# Altium project LM2587.PrjPcb
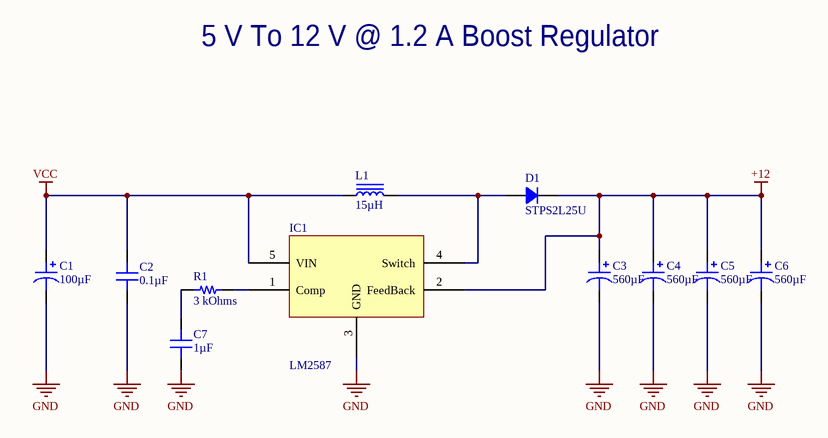
[diagram p0: LM2587.SchDoc]
1 sheet, 11 parts. Net scope: global (net labels, ports and power ports of the same name join across sheets).
Board file: LM2587.PcbDoc

## Sheet LM2587.SchDoc
size A4; SheetNumber: 1; SheetTotal: 1

### Parts
C1  100µF  [CAP ALSMD 6.6MM H5.4MM]
C2  0.1µF  [CAP 0805_2012]
C3  560µF  [CAP ALSMD 8.3MM H10.5MM]
C4  560µF  [CAP ALSMD 8.3MM H10.5MM]
C5  560µF  [CAP ALSMD 8.3MM H10.5MM]
C6  560µF  [CAP ALSMD 8.3MM H10.5MM]
C7  1µF  [CAP 0805_2012]
D1  STPS2L25U  [DO214AA SMB]
IC1  LM2587  [D2PAK - T0263]
L1  15µH  [7447070]
R1  3 kOhms  [RES 0805_2012]

### Nets
+12: C3.1 C4.1 C5.1 C6.1 D1.2 IC1.2(FeedBack)
GND: C1.2 C2.1 C3.2 C4.2 C5.2 C6.2 C7.1 IC1.3(GND)
VCC: C1.1 C2.2 IC1.5(VIN) L1.1
NetC7_2: C7.2 R1.1
NetD1_1: D1.1 IC1.4(Switch) L1.2
NetIC1_1: IC1.1(Comp) R1.2

### Notes on the sheet
- 5 V To 12 V @ 1.2 A Boost Regulator

### Library data of the parts
C1 = AVS107M16D16T-F: CAP ALUM 100UF 20% 16V SMD; Manufacturer: Cornell Dubilier Electronics (CDE); ESR (Equivalent Series Resistance): 4.3Ohm @ 120Hz; Lifetime @ Temp.: 2000 Hrs @ 85°C; Polarization: Polar; Ripple Current @ High Frequency: 119mA @ 10kHz; Ripple Current @ Low Frequency: 70mA @ 120Hz; Surface Mount Land Size: 0.260" L x 0.260" W (6.60mm x 6.60mm); Part Number: AVS107M16D16T-F; Applications: Automotive, Bypass, Decoupling; Capacitance: 100µF; ComponentLink1Description: Datasheet; ComponentLink1URL: http://www.cde.com/resources/catalogs/AVS.pdf; ComponentLink2Description: DigiKey Link; ComponentLink2URL: http://digikey.com/product-detail/en/cornell-dubilier-electronics-cde/AVS107M16D16T-F/338-3969-1-ND/5700222; Device Package: Radial, Can - SMD; Height - Seated (Max): 0.213" (5.40mm); LastUpdated: 2.09.2020 01:18:33; Lifecycle Status: Active; Minimum Order: 1; Mounting Type: Surface Mount; Operating Temperature: -40°C ~ 85°C; Package / Case: Radial, Can - SMD; Packaging: TapeAndReel; PartId: 8788; Part Status: Active; Price: 0.15; Ratings: AEC-Q200; Series: AVS; Size / Dimension: 0.248" Dia (6.30mm); Supplier 1: DigiKey; Supplier Part Number 1: 338-3969-1-ND; Tolerance: ±20%; Value: 100µF; Voltage - Rated: 16V
C2 = 08053E104ZAT2A: CAP CER 0.1UF 25V Z5U 0805; Manufacturer: AVX Corporation; Tolerance: -20%, +80%; Part Number: 08053E104ZAT2A; Value: 0.1µF; Applications: General Purpose; Capacitance: 0.1µF; ComponentLink2Description: DigiKey Link; ComponentLink2URL: http://digikey.com/product-detail/en/avx-corporation/08053E104ZAT2A/478-12769-1-ND/9949310; Device Package: 0805 (2012 Metric); LastUpdated: 2.09.2020 01:04:40; Lifecycle Status: Active; Minimum Order: 1; Mounting Type: Surface Mount, MLCC; Operating Temperature: 10°C ~ 85°C; Package / Case: 0805 (2012 Metric); Packaging: TapeAndReel; PartId: 3602; Part Status: Active; Price: 0.04; Series: -; Size / Dimension: 0.079" L x 0.049" W (2.00mm x 1.25mm); Supplier 1: DigiKey; Supplier Part Number 1: 478-12769-1-ND; Temperature Coefficient: Z5U; Thickness (Max): 0.037" (0.94mm); Voltage - Rated: 25V
C3-C6 = UCV1E561MNL1GS: CAP ALUM 560UF 20% 25V SMD; Manufacturer: Nichicon; Impedance: 80 mOhms; Lifetime @ Temp.: 2000 Hrs @ 105°C; Polarization: Polar; Ripple Current @ High Frequency: 850mA @ 100kHz; Ripple Current @ Low Frequency: 425mA @ 120Hz; Surface Mount Land Size: 0.327" L x 0.327" W (8.30mm x 8.30mm); Part Number: UCV1E561MNL1GS; Applications: General Purpose; Capacitance: 560µF; ComponentLink1Description: Datasheet; ComponentLink1URL: http://nichicon-us.com/english/products/pdfs/e-ucv.pdf; ComponentLink2Description: DigiKey Link; ComponentLink2URL: http://digikey.com/product-detail/en/nichicon/UCV1E561MNL1GS/493-14353-1-ND/5724340; Device Package: Radial, Can - SMD; Height - Seated (Max): 0.413" (10.50mm); LastUpdated: 2.09.2020 01:25:15; Lifecycle Status: Active; Minimum Order: 1; Mounting Type: Surface Mount; Operating Temperature: -55°C ~ 105°C; Package / Case: Radial, Can - SMD; Packaging: TapeAndReel; PartId: 7550; Part Status: Active; Price: 0.41; Series: UCV; Size / Dimension: 0.315" Dia (8.00mm); Supplier 1: DigiKey; Supplier Part Number 1: 493-14353-1-ND; Tolerance: ±20%; Value: 560µF; Voltage - Rated: 25V
C7 = C0805C105K3RACTU: CAP CER 1UF 25V X7R 0805; Manufacturer: KEMET; Tolerance: ±10%; Part Number: C0805C105K3RACTU; Value: 1µF; Applications: Bypass, Decoupling; Capacitance: 1µF; ComponentLink1Description: Datasheet; ComponentLink1URL: https://api.kemet.com/component-edge/download/datasheet/C0805C105K3RACTU.pdf; ComponentLink2Description: DigiKey Link; ComponentLink2URL: http://digikey.com/product-detail/en/kemet/C0805C105K3RACTU/399-8004-1-ND/3471727; Device Package: 0805 (2012 Metric); LastUpdated: 2.09.2020 01:04:42; Lifecycle Status: Active; Minimum Order: 1; Mounting Type: Surface Mount, MLCC; Operating Temperature: -55°C ~ 125°C; Package / Case: 0805 (2012 Metric); Packaging: TapeAndReel; PartId: 2575; Part Status: Active; Price: 0.02; Series: SMD Comm X7R; Size / Dimension: 0.079" L x 0.049" W (2.00mm x 1.25mm); Supplier 1: DigiKey; Supplier Part Number 1: 399-8004-1-ND; Temperature Coefficient: X7R; Thickness (Max): 0.055" (1.40mm); Voltage - Rated: 25V
D1 = STPS2L25U: DIODE SCHOTTKY 25V 2A SMB; Manufacturer: STMicroelectronics; Current - Reverse Leakage @ Vr: 90µA @ 25V; Speed: Fast Recovery =< 500ns, > 200mA (Io); Voltage - Forward (Vf) (Max) @ If: 450mV @ 2A; Part Number: STPS2L25U; ComponentLink1Description: Datasheet; ComponentLink1URL: http://www.st.com/content/ccc/resource/technical/document/datasheet/f9/71/8b/51/48/04/4b/9b/CD00001325.pdf/files/CD00001325.pdf/jcr:content/translations/en.CD00001325.pdf; ComponentLink2Description: DigiKey Link; ComponentLink2URL: http://digikey.com/product-detail/en/stmicroelectronics/STPS2L25U/497-5573-1-ND/1209742; Current - Average Rectified (Io): 2A; Diode Type: Schottky; LastUpdated: 2.09.2020 01:18:51; Lifecycle Status: Active; Minimum Order: 1; Mounting Type: Surface Mount; Operating Temperature - Junction: 150°C (Max); Package / Case: DO-214AA, SMB; Packaging: TapeAndReel; PartId: 1621; Part Status: Active; Price: 0.08; Series: -; Supplier 1: DigiKey; Supplier Part Number 1: 497-5573-1-ND; Supplier Device Package: SMB; Voltage - DC Reverse (Vr) (Max): 25V
L1 = SLF10165T-150M3R13PF: FIXED IND 15UH 3.1A 27 MOHM SMD; Manufacturer: TDK Corporation; DC Resistance (DCR): 32.4mOhm Max; Inductance Frequency - Test: 100kHz; Material - Core: Ferrite; Shielding: Shielded; Tolerance: ±20%; Type: Wirewound; Part Number: SLF10165T-150M3R13PF; ComponentLink1Description: Datasheet; ComponentLink1URL: https://product.tdk.com/info/en/catalog/datasheets/inductor_commercial_power_slf10165_en.pdf?ref_disty=digikey; ComponentLink2Description: DigiKey Link; ComponentLink2URL: http://digikey.com/product-detail/en/tdk-corporation/SLF10165T-150M3R13PF/445-6479-1-ND/2465805; Current Rating (Amps): 3.1A; Current - Saturation: 3.1A; Device Package: Nonstandard; Height - Seated (Max): 0.268" (6.80mm); Inductance: 15µH; LastUpdated: 2.09.2020 01:22:12; Lifecycle Status: Active; Minimum Order: 1; Mounting Type: Surface Mount; Operating Temperature: -40°C ~ 105°C; Package / Case: Nonstandard; Packaging: TapeAndReel; PartId: 99; Part Status: Active; Price: 0.59; Series: SLF; Size / Dimension: 0.398" L x 0.398" W (10.10mm x 10.10mm); Supplier 1: DigiKey; Supplier Part Number 1: 445-6479-1-ND; Value: 15µH
R1 = RPC0805JT3K00: RES 3K OHM 5% 1/4W 0805; Manufacturer: Stackpole Electronics Inc; Power (Watts): 0.25W, 1/4W; Temperature Coefficient: ±100ppm/°C; Part Number: RPC0805JT3K00; Value: 3 kOhms; ComponentLink1Description: Datasheet; ComponentLink1URL: https://www.seielect.com/catalog/sei-rpc.pdf; ComponentLink2Description: DigiKey Link; ComponentLink2URL: http://digikey.com/product-detail/en/stackpole-electronics-inc/RPC0805JT3K00/RPC0805JT3K00CT-ND/5766019; Composition: Thick Film; Device Package: 0805 (2012 Metric); Features: Automotive AEC-Q200, Pulse Withstanding; Height - Seated (Max): 0.024" (0.60mm); LastUpdated: 2.09.2020 01:14:56; Lifecycle Status: Active; Minimum Order: 1; Number of Terminations: 2; Operating Temperature: -55°C ~ 155°C; Package / Case: 0805 (2012 Metric); Packaging: TapeAndReel; PartId: 40639; Part Status: Active; Price: 0.02; Ratings: AEC-Q200; Resistance: 3 kOhms; Series: RPC; Size / Dimension: 0.079" L x 0.049" W (2.00mm x 1.25mm); Supplier 1: DigiKey; Supplier Part Number 1: RPC0805JT3K00CT-ND; Supplier Device Package: 0805; Tolerance: ±5%